# Altium schematic sheet 14.RK3588_VCCIO4.SchDoc
size A4; SheetNumber: 14; SheetTotal: 21
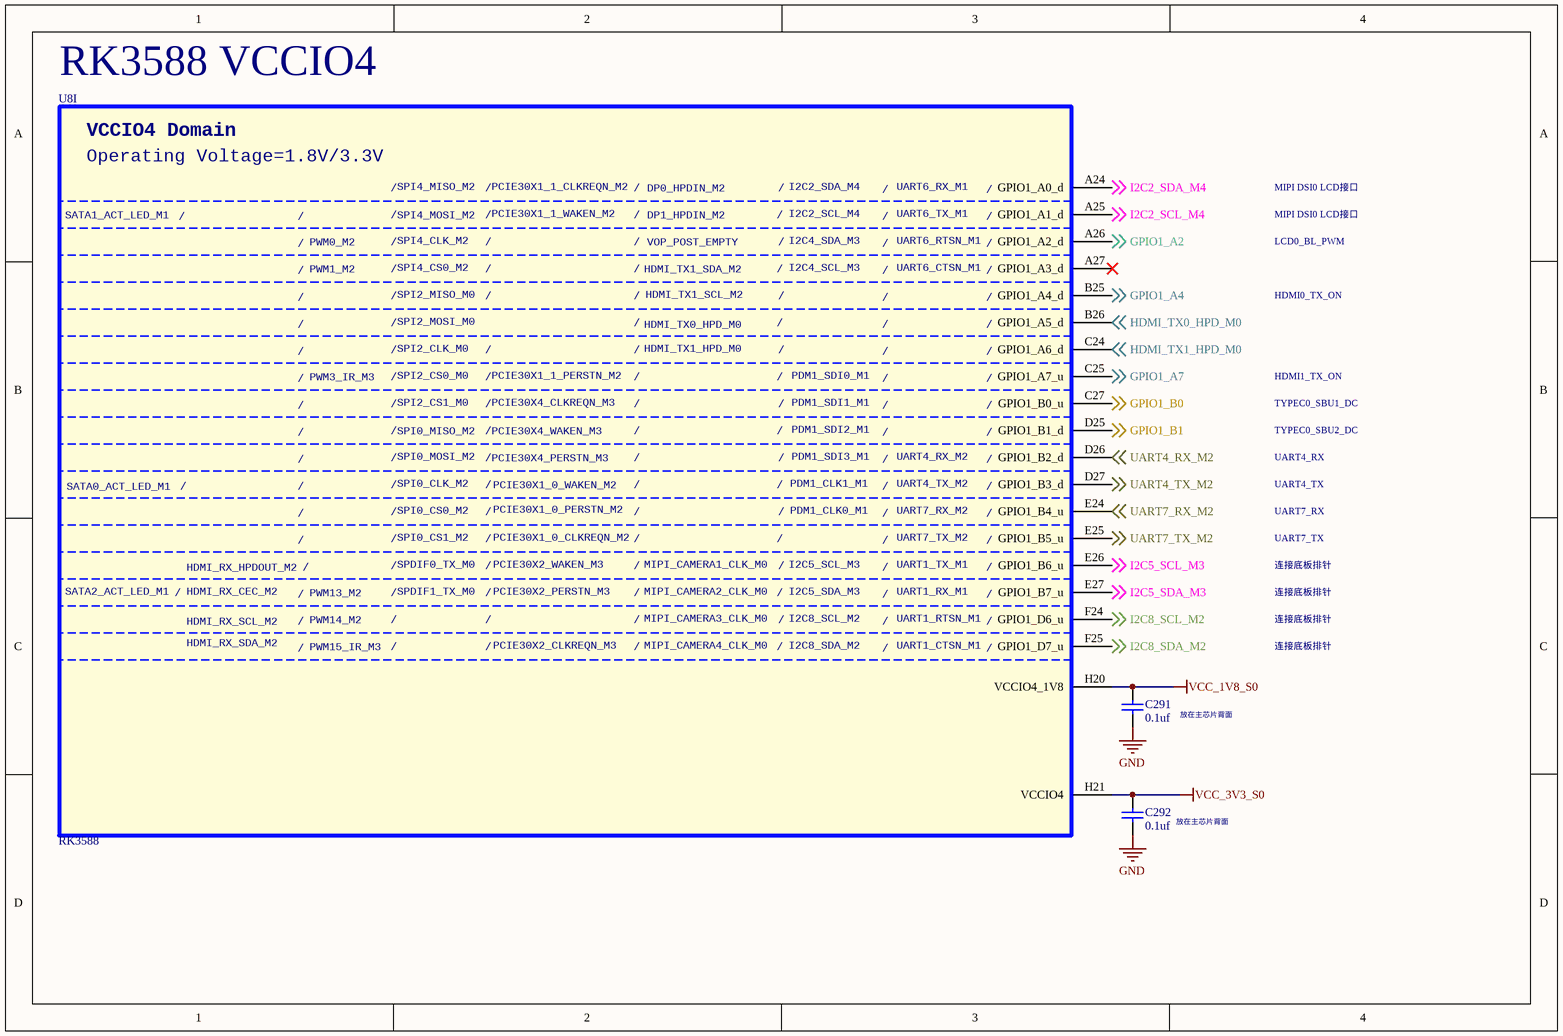
[diagram p0: 14.RK3588_VCCIO4.SchDoc]

## Parts
C291  0.1uf  [C0201_L]
C292  0.1uf  [C0201_L]
U8  RK3588  [BGA1088_23R00X23R00X2R00]  (part I of 26)

## Nets
GND: C291.1 C292.1
VCC_1V8_S0: C291.2 U8.H20(VCCIO4_1V8)
VCC_3V3_S0: C292.2 U8.H21(VCCIO4)
GPIO1_A2: U8.A26(GPIO1_A2_d) ; off-sheet GPIO1_A2
GPIO1_A4: U8.B25(GPIO1_A4_d) ; off-sheet GPIO1_A4
GPIO1_A7: U8.C25(GPIO1_A7_u) ; off-sheet GPIO1_A7
GPIO1_B0: U8.C27(GPIO1_B0_u) ; off-sheet GPIO1_B0
GPIO1_B1: U8.D25(GPIO1_B1_d) ; off-sheet GPIO1_B1
HDMI_TX0_HPD_M0: U8.B26(GPIO1_A5_d) ; off-sheet HDMI_TX0_HPD_M0
HDMI_TX1_HPD_M0: U8.C24(GPIO1_A6_d) ; off-sheet HDMI_TX1_HPD_M0
I2C2_SCL_M4: U8.A25(GPIO1_A1_d) ; off-sheet I2C2_SCL_M4
I2C2_SDA_M4: U8.A24(GPIO1_A0_d) ; off-sheet I2C2_SDA_M4
I2C5_SCL_M3: U8.E26(GPIO1_B6_u) ; off-sheet I2C5_SCL_M3
I2C5_SDA_M3: U8.E27(GPIO1_B7_u) ; off-sheet I2C5_SDA_M3
I2C8_SCL_M2: U8.F24(GPIO1_D6_u) ; off-sheet I2C8_SCL_M2
I2C8_SDA_M2: U8.F25(GPIO1_D7_u) ; off-sheet I2C8_SDA_M2
UART4_RX_M2: U8.D26(GPIO1_B2_d) ; off-sheet UART4_RX_M2
UART4_TX_M2: U8.D27(GPIO1_B3_d) ; off-sheet UART4_TX_M2
UART7_RX_M2: U8.E24(GPIO1_B4_u) ; off-sheet UART7_RX_M2
UART7_TX_M2: U8.E25(GPIO1_B5_u) ; off-sheet UART7_TX_M2

Not connected (* = marked no-connect by the designer): U8 A27(GPIO1_A3_d)*

## Notes on the sheet
- RK3588 VCCIO4
- MIPI DSI0 LCD接口
- LCD0_BL_PWM
- HDMI0_TX_ON
- HDMI1_TX_ON
- TYPEC0_SBU1_DC
- TYPEC0_SBU2_DC
- UART4_RX
- UART4_TX
- UART7_RX
- UART7_TX
- 连接底板排针
- (near C291) 放在主芯片背面
- (near C292) 放在主芯片背面
- (in symbol SOC_RK3588, part I) VCCIO4 Domain; Operating Voltage=1.8V/3.3V; /; SPI4_MISO_M2; PCIE30X1_1_CLKREQN_M2; DP0_HPDIN_M2; I2C2_SDA_M4; UART6_RX_M1; SATA1_ACT_LED_M1; SPI4_MOSI_M2; PCIE30X1_1_WAKEN_M2; DP1_HPDIN_M2; I2C2_SCL_M4; UART6_TX_M1; PWM0_M2; SPI4_CLK_M2; VOP_POST_EMPTY; I2C4_SDA_M3; UART6_RTSN_M1; PWM1_M2; SPI4_CS0_M2; HDMI_TX1_SDA_M2; I2C4_SCL_M3; UART6_CTSN_M1; SPI2_MISO_M0; HDMI_TX1_SCL_M2; SPI2_MOSI_M0; HDMI_TX0_HPD_M0; SPI2_CLK_M0; HDMI_TX1_HPD_M0; PWM3_IR_M3; SPI2_CS0_M0; PCIE30X1_1_PERSTN_M2; PDM1_SDI0_M1; SPI2_CS1_M0; PCIE30X4_CLKREQN_M3; PDM1_SDI1_M1; SPI0_MISO_M2; PCIE30X4_WAKEN_M3; PDM1_SDI2_M1; SPI0_MOSI_M2; PCIE30X4_PERSTN_M3; PDM1_SDI3_M1; UART4_RX_M2; SATA0_ACT_LED_M1; SPI0_CLK_M2; PCIE30X1_0_WAKEN_M2; PDM1_CLK1_M1; UART4_TX_M2; SPI0_CS0_M2; PCIE30X1_0_PERSTN_M2; PDM1_CLK0_M1; UART7_RX_M2; SPI0_CS1_M2; PCIE30X1_0_CLKREQN_M2; UART7_TX_M2; HDMI_RX_HPDOUT_M2; SPDIF0_TX_M0; PCIE30X2_WAKEN_M3; MIPI_CAMERA1_CLK_M0; I2C5_SCL_M3; UART1_TX_M1; SATA2_ACT_LED_M1; HDMI_RX_CEC_M2; PWM13_M2; SPDIF1_TX_M0; PCIE30X2_PERSTN_M3; MIPI_CAMERA2_CLK_M0; I2C5_SDA_M3; UART1_RX_M1; HDMI_RX_SCL_M2; PWM14_M2; MIPI_CAMERA3_CLK_M0; I2C8_SCL_M2; UART1_RTSN_M1; HDMI_RX_SDA_M2; PWM15_IR_M3; PCIE30X2_CLKREQN_M3; MIPI_CAMERA4_CLK_M0; I2C8_SDA_M2; UART1_CTSN_M1

## Library data of the parts
C291 C292 = C: 贴片电容/MLCC电容
U8 = SOC_RK3588: ROCKCHIP SOC